# EasyEDA Pro project ProDocument_V3_2024-06-08.epro

# Schematic Schematic6
Create Date: 2024-04-19; Page Name: P1; Project Name: 变频器; Schematic Name: Schematic6; Update Date: 2024-04-24; Company: 嘉立创EDA; Page Size: A4; Version: V1.0
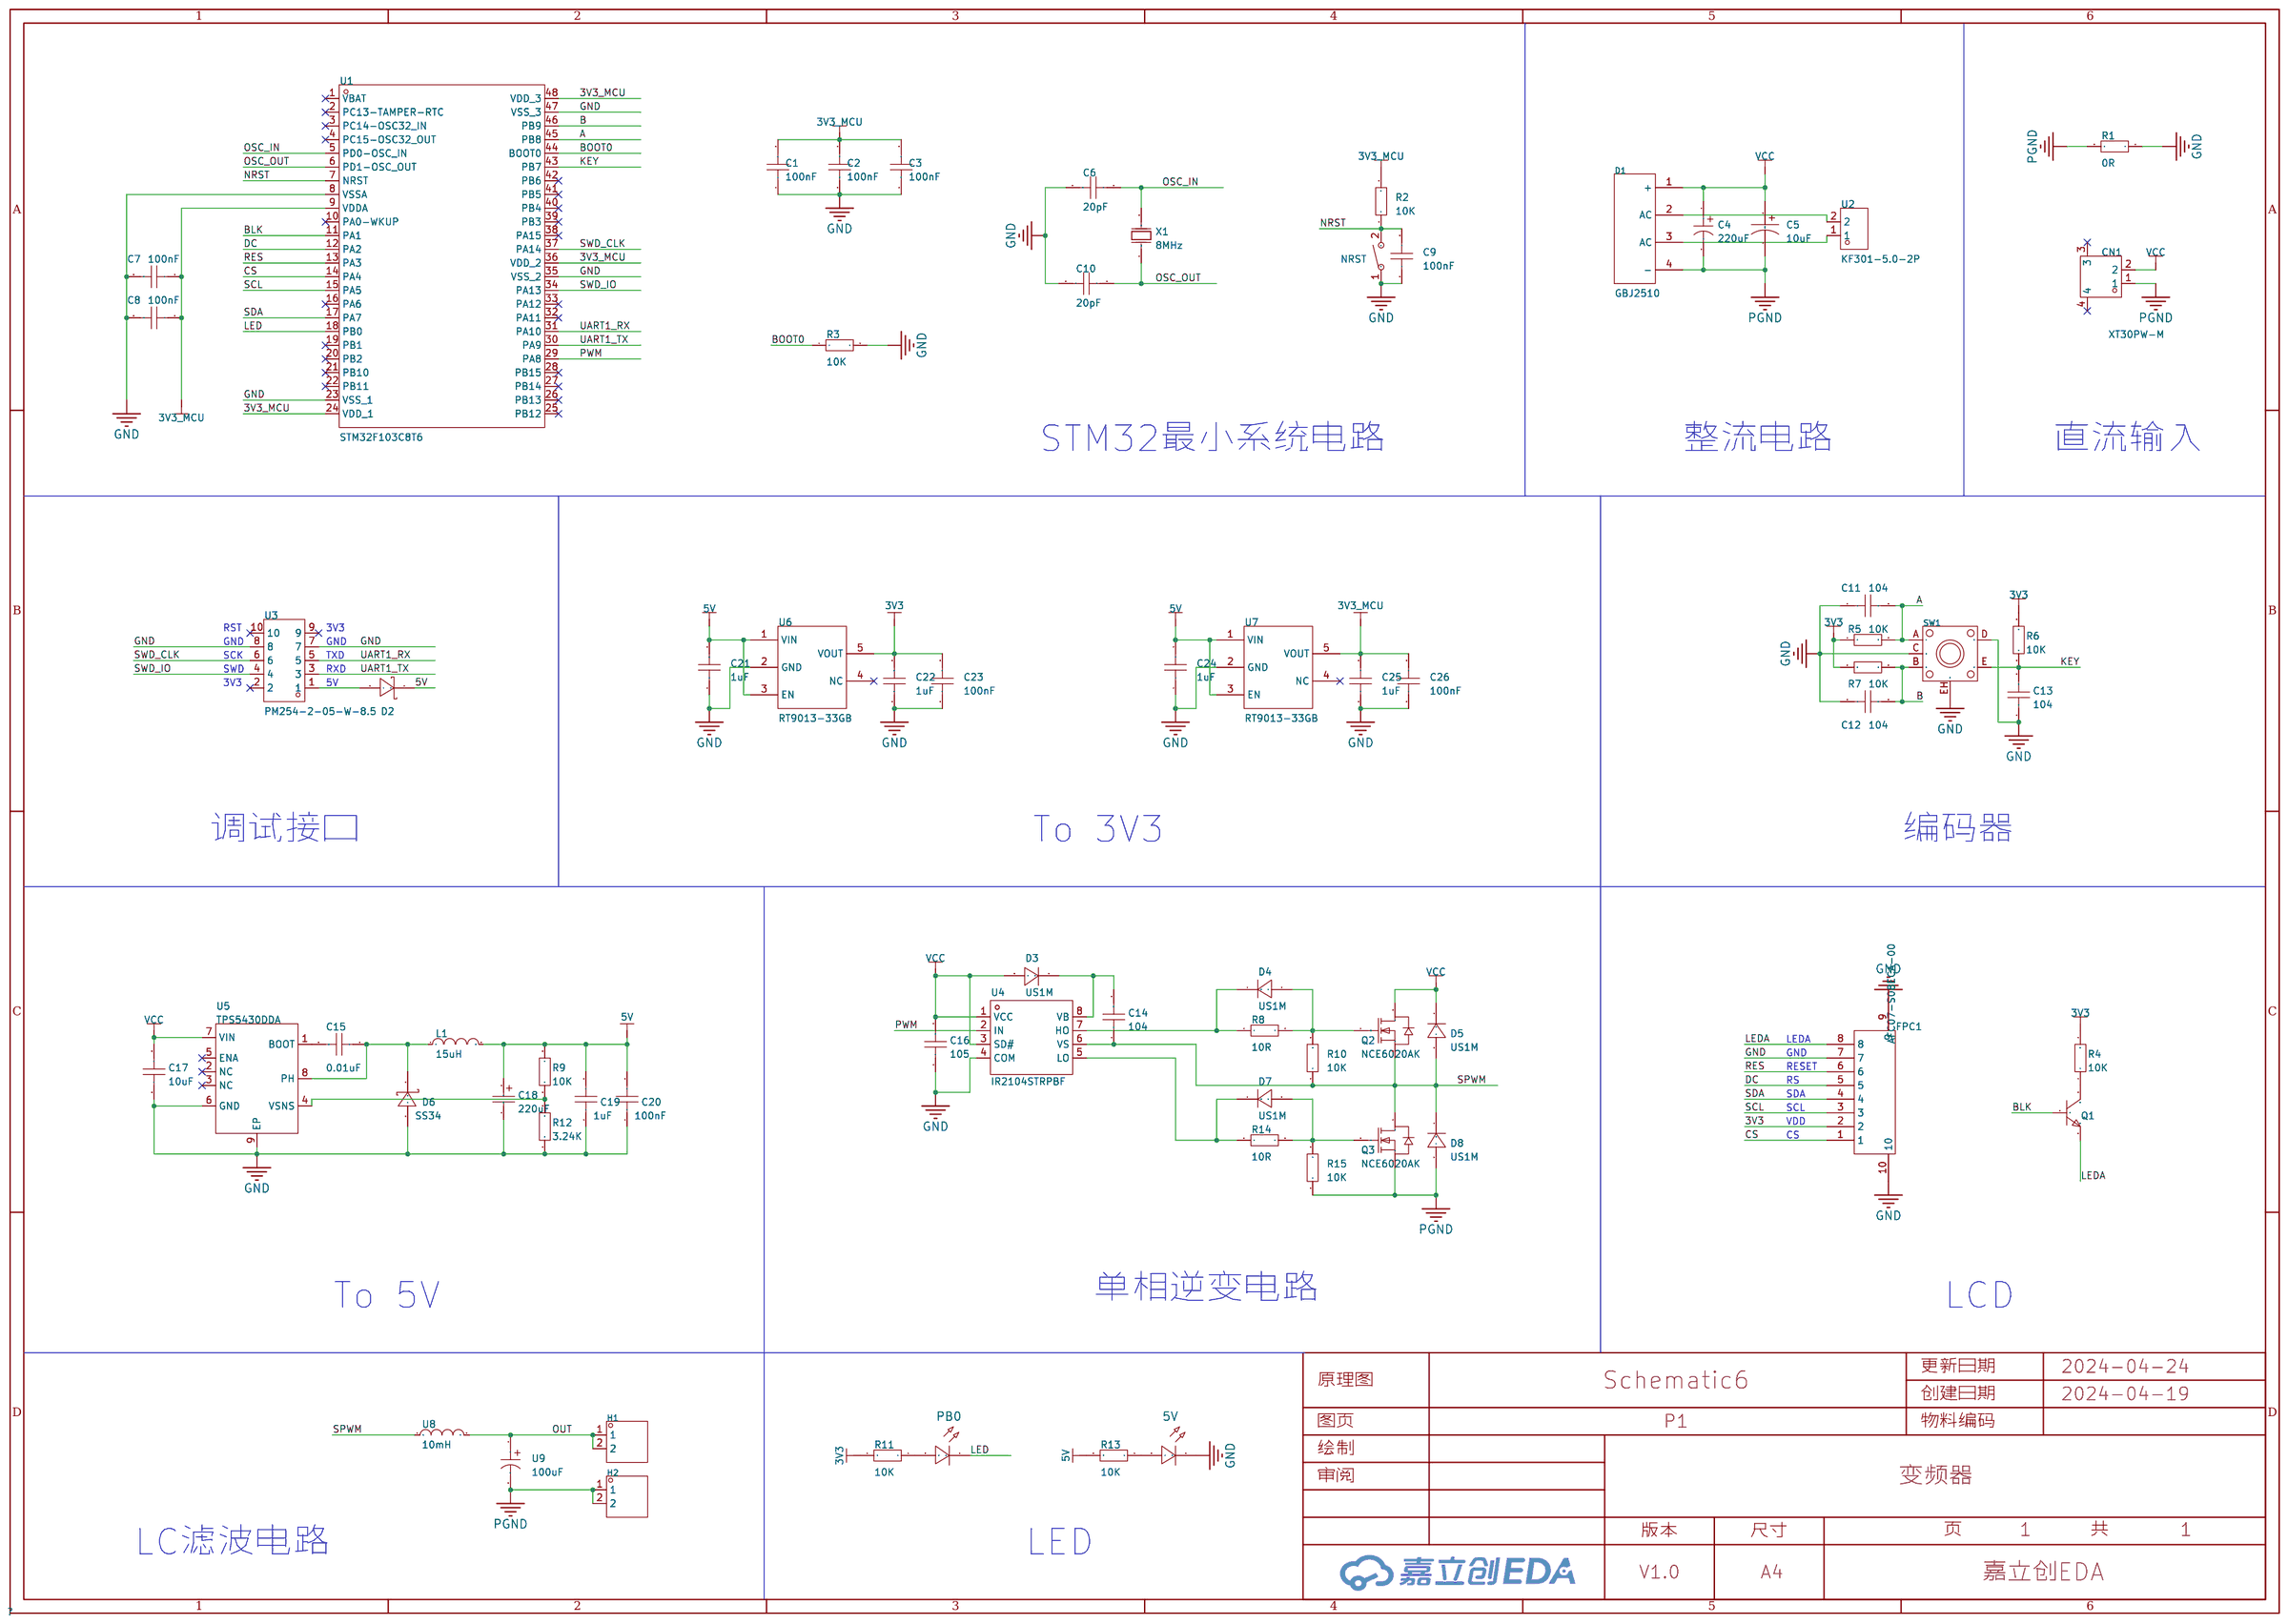
[diagram p0: schematic sheet]

## Parts
5V  -  [LED_0603]
C1  100nF  [C0603]
C2  100nF  [C0603]
C3  100nF  [C0603]
C4  220uF  [CAP-TH_BD8.0-P3.50-D0.6-FD]
C5  10uF  [CAP-TH_BD5.0-P2.00-D0.8-FD]
C6  20pF  [C0603]
C7  100nF  [C0603]
C8  100nF  [C0603]
C9  100nF  [C0603]
C10  20pF  [C0603]
C11  104  [C0603]
C12  104  [C0603]
C13  104  [C0603]
C14  104  [C0603]
C15  100nF  [C0603]
C16  105  [C0603]
C17  100nF  [C0603]
C18  220uF  [CASE-D_7343]
C19  100nF  [C0603]
C20  100nF  [C0603]
C21  100nF  [C0603]
C22  100nF  [C0603]
C23  100nF  [C0603]
C24  100nF  [C0603]
C25  100nF  [C0603]
C26  100nF  [C0603]
CN1  XT30PW-M  [CONN-TH_XT30PW-M]
D1  GBJ2510  [DIO-BG-TH_PB]
D2  1N5819WS  [SOD-323_L1.8-W1.3-LS2.5-RD]
D3  US1M  [SMA_L4.4-W2.8-LS5.4-RD]
D4  US1M  [SMA_L4.4-W2.8-LS5.4-RD]
D5  US1M  [SMA_L4.4-W2.8-LS5.4-RD]
D6  SS34  [SMA_L4.3-W2.6-LS5.2-RD]
D7  US1M  [SMA_L4.4-W2.8-LS5.4-RD]
D8  US1M  [SMA_L4.4-W2.8-LS5.4-RD]
FPC1  AFC07-S08ECA-00  [FPC-SMD_P0.5-8P_LCS-SH-H2.0]
H1  -  [HDR-TH_2P-P2.54-V-M-1]
H2  -  [HDR-TH_2P-P2.54-V-M-1]
L1  15uH  [IND-SMD_L7.0-W6.6_FXL0630]
NRST  TS-1071AD-A1B3-D4  [SW-SMD_L4.0-W3.0-LS4.8]
PB0  -  [LED_0603]
Q1  -  [S8050_SOT-23]
Q2  NCE6020AK  [TO-252-2_L6.6-W6.1-P4.57-LS10.1-TL-CW]
Q3  NCE6020AK  [TO-252-2_L6.6-W6.1-P4.57-LS10.1-TL-CW]
R1  0R  [R0603]
R2  10K  [R0603]
R3  10K  [R0603]
R4  10K  [R0603]
R5  10K  [R0603]
R6  10K  [R0603]
R7  10K  [R0603]
R8  10R  [R0603]
R9  10K  [R0603]
R10  10K  [R0603]
R11  10K  [R0603]
R12  10K  [R0603]
R13  10K  [R0603]
R14  10R  [R0603]
R15  10K  [R0603]
SW1  EC11N1520401  [SW-TH_EC11NXXXX]
U1  STM32F103C8T6  [LQFP-48_L7.0-W7.0-P0.50-LS9.0-BL]
U2  KF301-5.0-2P  [CONN-TH_P5.00_KF301-5.0-2P]
U3  PM254-2-05-W-8.5  [HDR-TH_10P-P2.54-H-F-R2-C5-W8.5]
U4  IR2104STRPBF  [SOIC-8_L4.9-W3.9-P1.27-LS6.0-BL]
U5  TPS5430DDA  [ESOP-8_L4.9-W3.9-P1.27-LS6.0-BL-EP-2]
U6  RT9013-33GB  [SOT-23-5_L3.0-W1.7-P0.95-LS2.8-BL]
U7  RT9013-33GB  [SOT-23-5_L3.0-W1.7-P0.95-LS2.8-BL]
U8  10mH  [IND-TH_BD10.0-P5.00-D0.6]
U9  100uF  [CAP-TH_BD8.0-P3.50-D0.6-FD]
X1  8MHz  [CRYSTAL-SMD_L5.0-W3.2]

## Library data of the parts
5V PB0 = LED_0603-R: Supplier Footprint: 0603
C1-C3 C6-C17 C19-C26 = CAP_0603: Supplier Footprint: 0603
C4 = 01EC3470: 容值:220uF;精度:±20%;额定电压:50V;纹波电流:350mA@120kHz;等效串联电阻:-;; LCSC Part Name: 220uF ±20% 50V; Supplier Part: C2836445; Manufacturer: KNSCHA(科尼盛); Supplier Footprint: 插件,D8xL12mm; JLCPCB Part Class: 扩展库; Datasheet: https://atta.szlcsc.com/upload/public/pdf/source/20210528/C2836445_4EB3DEC3C45633977FB5495C9B2E1697.pdf; Supplier: LCSC; Tolerance: ±20%; Rated Voltage: 50V; Ripple Current: 350mA@120kHz; Lead Spacing: 3.5mm; φD: 8mm; L: 12mm; Lifetime @ Temp: 2000hrs@105℃; Operating Temperature: -40℃~+105℃
C5 = 01EC1809SHC10UF50V: 容值:10uF;精度:±20%;额定电压:50V;纹波电流:50mA@120Hz;等效串联电阻:-;; LCSC Part Name: 10uF ±20% 50V; Supplier Part: C503219; Manufacturer: KNSCHA(科尼盛); Supplier Footprint: 插件,D5xL11mm; JLCPCB Part Class: 扩展库; Datasheet: https://atta.szlcsc.com/upload/public/pdf/source/20200324/C503219_39D1683F20D4DB1C41D8BE9142629697.pdf; Supplier: LCSC; Tolerance: ±20%; Rated Voltage: 50V; Ripple Current: 50mA@120Hz; Lead Spacing: 2mm; φD: 5mm; L: 11mm; Lifetime @ Temp: 5000hrs@105℃
C18 = TAJD227K010RNJ: 容值:220uF;精度:±10%;额定电压:10V;等效串联电阻:500mΩ@100kHz;; LCSC Part Name: 220uF ±10% 10V; Supplier Part: C8024; Manufacturer: Kyocera AVX; Supplier Footprint: CASE-D-7343; JLCPCB Part Class: 扩展库; Datasheet: https://atta.szlcsc.com/upload/public/pdf/source/20160107/1457707750344.pdf; Supplier: LCSC; Tolerance: ±10%; Rated Voltage: 10V; Equivalent Series Resistance(ESR): 500mΩ@100kHz; Operating Temperature: -55℃~+125℃
CN1 = XT30PW-M: Socket,DCsupply,XT30,male,PIN:2; LCSC Part Name: XT30PW-M公头; Supplier Part: C431092; Manufacturer: AMASS(艾迈斯); Supplier Footprint: Through Hole; JLCPCB Part Class: Extended Part; Datasheet: https://atta.szlcsc.com/upload/public/pdf/source/20220222/6A9F22F7850E25B33E1BE430ADF8560B.pdf; Supplier: LCSC
D1 = GBJ2510_C27523: 正向压降(Vf):1.05V@12.5A;直流反向耐压(Vr):1kV;平均整流电流(Io):25A;正向浪涌电流(Ifsm):350A;; LCSC Part Name: 电压:1kV 电流:25A; Supplier Part: C27523; Manufacturer: MDD; Supplier Footprint: GBJ6; JLCPCB Part Class: Extended Part; Datasheet: https://atta.szlcsc.com/upload/public/pdf/source/20190305/C27523_422085F399E74C82CD07F90440620E8B.pdf; Supplier: LCSC; Forward Voltage (Vf@If): 1.05V@12.5A; Reverse Voltage (Vr): 1kV; Average Rectified Current (Io): 25A; Reverse Leakage Current (Ir): 10uA@1kV; Peak Forward Surge Current: 350A; Operating Temperature: -55℃~+150℃@(Tj)
D2 = 1N5819WS_C191023: 正向压降(Vf):600mV@1A;直流反向耐压(Vr):40V;平均整流电流(Io):1A;; LCSC Part Name: 电压:40V 电流:1A; Supplier Part: C191023; Manufacturer: Hottech(合科泰); Supplier Footprint: SOD-323; JLCPCB Part Class: Basic Part; Datasheet: https://atta.szlcsc.com/upload/public/pdf/source/20220428/3CB86FD8D28D653594B4E35F9D5AEFD9.pdf; Supplier: LCSC; Forward Voltage (Vf@If): 600mV@1A; Reverse Voltage (Vr): 40V; Average Rectified Current (Io): 1A
D3-D5 D7 D8 = US1M_C412437: 二极管配置:独立式;正向压降(Vf):1.7V@1A;直流反向耐压(Vr):1kV;平均整流电流(Io):1A;反向恢复时间(trr):75ns;; LCSC Part Name: 电压:1kV 电流:1A; Supplier Part: C412437; Manufacturer: MDD; Supplier Footprint: SMA; JLCPCB Part Class: Basic Part; Datasheet: https://atta.szlcsc.com/upload/public/pdf/source/20230314/F0756B025DF5B8F55B4CA0C779F501E8.pdf; Supplier: LCSC; Diode Configuration: 独立式; Forward Voltage (Vf@If): 1.7V@1A; Reverse Voltage (Vr): 1kV; Average Rectified Current (Io): 1A; Reverse Leakage Current: 5uA@1kV; Reverse Recovery Time (trr): 75ns; Operating Temperature: -50℃~+150℃@(Tj)
D6 = SS34_C8678: 二极管配置:独立式;直流反向耐压(Vr):40V;平均整流电流(Io):3A;正向压降(Vf):550mV@3A;反向电流(Ir):500uA@40V;; LCSC Part Name: 40V 3A 550mV@3A; Supplier Part: C8678; Manufacturer: MDD; Supplier Footprint: SMA(DO-214AC); JLCPCB Part Class: Basic Part; Datasheet: https://atta.szlcsc.com/upload/public/pdf/source/20220408/D0396E57A6E83C6AFC0ED25EC9EDE030.pdf; Supplier: LCSC; Diode Configuration: 独立式; Reverse Voltage (Vr): 40V; Average Rectified Current (Io): 3A; Forward Voltage (Vf@If): 550mV@3A; Reverse Leakage Current (Ir): 500uA@40V
FPC1 = AFC07-S08ECA-00: 间距:0.5mm;触点数量:8P;锁定特性:抽屉式;触点类型:上接;安装类型:卧贴;; LCSC Part Name: 间距:0.5mm P数:8P 抽屉式 上接; Supplier Part: C262581; Manufacturer: JS(钜硕电子); Supplier Footprint: SMD,P=0.5mm,卧贴; JLCPCB Part Class: Extended Part; Datasheet: https://atta.szlcsc.com/upload/public/pdf/source/20190726/C11082_A2E7B12387019CE4314BB5199EE0FDF4.pdf; Supplier: LCSC; Pitch: 0.5mm; Number of Contacts: 8P; Locking Feature: 抽屉式; FFC, FCB Thickness: 0.3mm; Contact Type: 上接; Mounting Type: 卧贴; Height Above Board: 2mm
H1 H2 = HDR-M_2.54_1x2P: Supplier Part: C124375; Supplier Footprint: 插件
L1 = FXL0630-150-M: 电感值:15uH;精度:±20%;额定电流:3A;饱和电流(Isat):4.5A;类型:一体成型电感;; LCSC Part Name: 15uH ±20% 4.5A; Supplier Part: C177243; Manufacturer: cjiang(长江微电); Supplier Footprint: SMD,6.6x7mm; JLCPCB Part Class: Extended Part; Datasheet: https://atta.szlcsc.com/upload/public/pdf/source/20230516/3A080F5AF8C87BB81C3BA86E5F60E51A.pdf; Supplier: LCSC; Tolerance: ±20%; Rated Current: 3A; Saturation Current (Isat): 4.5A; DC Resistance (DCR): 115mΩ; Type: 一体成型电感
NRST = TS-1071AD-A1B3-D4: 电路结构:单刀单掷;按钮形状:圆形按钮;作用力:250gf;安装方式:-;开关长度:4mm;开关宽度:3mm;开关高度:2mm;带灯:-;机械寿命:-;; LCSC Part Name: 轻触开关4.0*3.0*2两脚贴片无柱小龟250gf; Supplier Part: C492878; Manufacturer: Yuandi(元迪); JLCPCB Part Class: Extended Part; Datasheet: https://atta.szlcsc.com/upload/public/pdf/source/20200316/C492878_F665FC46291D1CEBBF5F4DDB4422506A.pdf; Supplier: LCSC; Circuit: 单刀单掷; Actuator Style: 圆形按钮; Operating Force: 250gf; Switch Length: 4mm; Switch Width: 3mm; Switch Height: 2mm
Q1 = S8050_SOT_NPN: Supplier Footprint: SOT-23
Q2 Q3 = NCE6020AK: 类型:N沟道;漏源电压(Vdss):60V;连续漏极电流(Id):20A;功率(Pd):45W;导通电阻(RDS(on)@Vgs,Id):35mΩ@10V,20A;阈值电压(Vgs(th)@Id):2.5V@250uA;; LCSC Part Name: N沟道 耐压:60V 电流:20A; Supplier Part: C108639; Manufacturer: NCE(无锡新洁能); Supplier Footprint: TO-252-2(DPAK); JLCPCB Part Class: Extended Part; Datasheet: https://atta.szlcsc.com/upload/public/pdf/source/20231201/F7F8CF8E769EE35C01C69D8E45471040.pdf; Supplier: LCSC; Type: N沟道; Drain Source Voltage (Vdss): 60V; Continuous Drain Current (Id): 20A; Power Dissipation (Pd): 45W; Drain Source On Resistance (RDS(on)@Vgs,Id): 35mΩ@10V,20A; Gate Threshold Voltage (Vgs(th)@Id): 2.5V@250uA
R1-R15 = Res_0603: Supplier Footprint: 0603
SW1 = EC11N1520401: Supplier Part: C470703; Manufacturer: ALPSALPINE(阿尔卑斯阿尔派); Supplier Footprint: 插件; JLCPCB Part Class: 扩展库; Datasheet: https://atta.szlcsc.com/upload/public/pdf/source/20191216/C470795_DE763ECE59BD49533DB26DB53E5D34B2.pdf; Supplier: LCSC
U1 = STM32F103C8T6: CPU内核:CM3;程序存储容量:64KB;RAM总容量:20KB;GPIO端口数量:37;工作电压范围:2V~3.6V;CPU最大主频:72MHz;程序存储器类型:FLASH;; LCSC Part Name: STM32F103C8T6 MSL=3; Supplier Part: C8734; Manufacturer: ST(意法半导体); Supplier Footprint: LQFP-48(7x7); JLCPCB Part Class: 扩展库; Datasheet: https://atta.szlcsc.com/upload/public/pdf/source/20220812/8363ACEC51AD55ECEB84799464F7CB85.pdf; Supplier: LCSC; CPU Core: CM3; Program Storage Size: 64KB; RAM Size: 20KB; GPIO Ports Number: 37; Operating Voltage Range: 2V~3.6V; CPU Maximum Speed: 72MHz; Program Memory Type: FLASH; Operating Temperature Range: -40℃~+85℃; ADC (Bit): 12bit; Universal Serial Bus: 有; Peripheral/Function: 看门狗；DMA；看门狗；片载温度传感器; Watchdog: 有; Infrared Data Association: 有; Low-Voltage Detect: 有; Direct Memory Access: 有; Internal Oscillator: 有
U2 = KF301-5.0-2P: 结构:1x2P;间距:5mm;颜色:蓝色;安装方式:直插;额定电流:17A;额定电压:250V;排数:1;线规 - AWG:14~22;线规 - 平方毫米:1.5;每排PIN数:2;工作温度范围:-30℃~+120℃;; LCSC Part Name: 5mm 1x2P 排数:1 每排P数:2 直插; Supplier Part: C474881; Manufacturer: KEFA(科发); Supplier Footprint: 插件,P=5mm; JLCPCB Part Class: 扩展库; Datasheet: https://atta.szlcsc.com/upload/public/pdf/source/20230317/03A5B5FC229D6F9225E8F51DA1A4E80A.pdf; Supplier: LCSC; Structure: 1x2P; Pitch: 5mm; Color: 蓝色; Mounting Style: 直插; Current Rating (Max): 17A; Voltage Rating (Max): 250V; Number of Pins: 2P; Number of Rows: 1; Wire Gauge - AWG: 14~22; Wire Gauge - mm2: 1.5; Number of PINs Per Row: 2; Operating Temperature Range: -30℃~+120℃
U3 = PM254-2-05-W-8.5: 排数:双排;总孔位数:10P;间距:2.54mm;插孔结构:2x5P;行距:2.54mm;安装类型:弯插;圆孔/方孔:方孔;额定电流:3A;额定电压:-;插孔方向:侧面;塑高:8.5mm;工作温度范围:-40℃~+105℃;; LCSC Part Name: 间距:2.54mm 2x5P 弯插; Supplier Part: C2897425; Manufacturer: HCTL(华灿天禄); Supplier Footprint: 弯插,P=2.54mm; JLCPCB Part Class: 扩展库; Datasheet: https://atta.szlcsc.com/upload/public/pdf/source/20230609/283C0D22EF4E6FFE03D5A855876981ED.pdf; Supplier: LCSC; Number of Rows: 双排; Number of Holes: 10P; Pitch: 2.54mm; Holes Structure: 2x5P; Row Spacing: 2.54mm; Mounting Type: 弯插; Circular Hole / Square Hole: 方孔; Current Rating (Max): 3A; Holes Direction: 侧面; Insulation Height: 8.5mm; Operating Temperature Range: -40℃~+105℃
U4 = IR2104STRPBF: 驱动配置:半桥;负载类型:MOSFET；IGBT;驱动通道数:2;峰值灌电流:360mA;峰值拉电流:210mA;电源电压:10V~20V;上升时间:100ns;下降时间:50ns;; Supplier Part: C2960; Manufacturer: Infineon(英飞凌); Supplier Footprint: SOIC-8; JLCPCB Part Class: 扩展库; Datasheet: https://atta.szlcsc.com/upload/public/pdf/source/20140906/1457707236579.pdf; Supplier: LCSC; Driven Configuration: 半桥; Load Type: MOSFET；IGBT; Number of Drivers: 2; Peak Output Current(sink): 360mA; Peak Output Current(source): 210mA; Supply Voltage: 10V~20V; Rise Time: 100ns; Fall Time: 50ns; Operating Temperature: -40℃~+150℃@(Tj)
U5 = TPS5430DDA: 功能类型:降压型;同步整流:否;输出类型:可调;输出通道数:1;拓扑结构:降压式;输入电压:5.5V~36V;输出电压:1.221V~32.04V;输出电流(最大值):3A;开关频率:500kHz;工作温度:-40~+125@(TJ);; LCSC Part Name: 降压型 Vin=5.5V~36V Vout=1.221V~32.04V 3A; Supplier Part: C502477; Manufacturer: TI(德州仪器); Supplier Footprint: ESOP-8; JLCPCB Part Class: Extended Part; Datasheet: https://atta.szlcsc.com/upload/public/pdf/source/20200402/C502477_C195E9F29489A337252CB245AFB38C93.pdf; Supplier: LCSC; Function: 降压型; Synchronous Rectification: 否; Output Type: 可调; Number of Outputs: 1; Topology: 降压式; Input Voltage: 5.5V~36V; Output Voltage: 1.221V~32.04V; Output Current (Max): 3A; Switching Frequency: 500kHz; Operating Temperature: -40~+125@(TJ)
U6 U7 = RT9013-33GB: 输出类型:固定;最大输入电压:5.5V;输出电压:3.3V;最大输出电流:500mA;电源纹波抑制比(PSRR):50dB@(10kHz);输出极性:正极;; LCSC Part Name: 输入5.5V 输出3.3V 500mA; Supplier Part: C47773; Manufacturer: RICHTEK(立锜); Supplier Footprint: SOT-23-5; JLCPCB Part Class: 扩展库; Datasheet: https://atta.szlcsc.com/upload/public/pdf/source/20150504/1457707282459.pdf; Supplier: LCSC; Output Type: 固定; Maximum Input Voltage: 5.5V; Output Voltage: 3.3V; MAX Output Current: 500mA; Power Supply Rejection Ratio (PSRR): 50dB@(10kHz); Dropout Voltage: 400mV@(500mA); standby current: 50uA; Operating Temperature: -40℃~+85℃; Output Polarity: 正极; Number of Outputs: 1
U8 = XR8*10-101K-L: 电感值:100uH;精度:±10%;类型:工字电感;; LCSC Part Name: 100uH ±10% 工字电感; Supplier Part: C5380241; Manufacturer: XR(祥如); Supplier Footprint: 插件,D8xL10mm; JLCPCB Part Class: 扩展库; Datasheet: https://atta.szlcsc.com/upload/public/pdf/source/20230323/E8473EC4B67CAA12E996DDE863677D9C.pdf; Supplier: LCSC; Tolerance: ±10%; Type: 工字电感
U9 = 8471LCM0812LEN91EC: 容值:470uF;精度:±20%;额定电压:16V;; LCSC Part Name: 470uF ±20% 16V; Supplier Part: C5346386; Manufacturer: FH(风华); Supplier Footprint: 直插,D8xL12mm; JLCPCB Part Class: Extended Part; Datasheet: https://atta.szlcsc.com/upload/public/pdf/source/20230112/BBAEF8379DDF9FCDF3CF9581580F9F7A.pdf; Supplier: LCSC; Tolerance: ±20%; Rated Voltage: 16V; φD: 8mm; L: 12mm
X1 = X50328MSB2GI: 晶振类型:贴片晶振;频率:8MHz;常温频差:±10ppm;外接负载电容:20pF;频率稳定度(全温):±20ppm;; LCSC Part Name: 8MHz ±10ppm 20pF YSX530GA; Supplier Part: C115962; Manufacturer: YXC(扬兴晶振); Supplier Footprint: SMD5032; JLCPCB Part Class: 基础库; Datasheet: https://atta.szlcsc.com/upload/public/pdf/source/20240329/44922B0AF7B60E58E9B66993B6077277.pdf; Supplier: LCSC; Crystal Type: 贴片晶振; Normal temperature Frequency Tolerance: ±10ppm; External load capacitor: 20pF; Frequency Stability(Full temperature range): ±20ppm; Operating Temperature: -40℃~+85℃

## Nets
3V3: C22.2 C23.2 FPC1.2 R4.2 R5.1 R6.2 R7.1 R11.2 U6.5(VOUT)
3V3_MCU: C1.2 C2.2 C3.2 C7.1 C8.1 C25.2 C26.2 R2.2 U1.9(VDDA) U1.24(VDD_1) U1.36(VDD_2) U1.48(VDD_3) U7.5(VOUT)
5V: C18.1 C19.2 C20.2 C21.2 C24.2 D2.1(K) L1.2 R9.2 R13.2 U6.1(VIN) U6.3(EN) U7.1(VIN) U7.3(EN)
GND: 5V.1(C) C1.1 C2.1 C3.1 C6.2 C7.2 C8.2 C9.1 C10.2 C11.1 C12.1 C13.1 C16.1 C17.1 C18.2 C19.1 C20.1 C21.1 C22.1 C23.1 C24.1 C25.1 C26.1 D6.2(A) FPC1.7 FPC1.9 FPC1.10 NRST.1 R1.1 R3.2 R12.1 SW1.C SW1.D SW1.EH U1.8(VSSA) U1.23(VSS_1) U1.35(VSS_2) U1.47(VSS_3) U3.7 U3.8 U4.4(COM) U5.6(GND) U5.9(EP) U6.2(GND) U7.2(GND)
PGND: C4.2 C5.2 CN1.1 D1.4(-) D8.2(A) H2.1 H2.2 Q3.3(S) R1.2 R15.1 U9.2
VCC: C4.1 C5.1 C16.2 C17.2 CN1.2 D1.1(+) D3.2(A) D5.1(C) Q2.2(D) U4.1(VCC) U4.3(SD#) U5.7(VIN)
A: C11.2 R5.2 SW1.A U1.45(PB8)
B: C12.2 R7.2 SW1.B U1.46(PB9)
BLK: Q1.1 U1.11(PA1)
BOOT0: R3.1 U1.44(BOOT0)
CS: FPC1.1 U1.14(PA4)
DC: FPC1.5 U1.12(PA2)
KEY: C13.2 R6.1 SW1.E U1.43(PB7)
LED: PB0.1(C) U1.18(PB0)
LEDA: FPC1.8 Q1.2
NRST: C9.2 NRST.2 R2.1 U1.7(NRST)
OSC_IN: C6.1 U1.5(PD0-OSC_IN) X1.2(OSC2)
OSC_OUT: C10.1 U1.6(PD1-OSC_OUT) X1.1(OSC1)
OUT: H1.1 H1.2 U8.2 U9.1
PWM: U1.29(PA8) U4.2(IN)
RES: FPC1.6 U1.13(PA3)
SCL: FPC1.3 U1.15(PA5)
SDA: FPC1.4 U1.17(PA7)
SPWM: C14.1 D5.2(A) D8.1(C) Q2.3(S) Q3.2(D) R10.1 U4.6(VS) U8.1
SWD_CLK: U1.37(PA14) U3.6
SWD_IO: U1.34(PA13) U3.4
UART1_RX: U1.31(PA10) U3.5
UART1_TX: U1.30(PA9) U3.3
$1N2965: C14.2 D3.1(C) U4.8(VB)
$1N2966: D4.1(C) R8.1 U4.7(HO)
$1N2967: D4.2(A) Q2.1(G) R8.2 R10.2
$1N2968: D7.2(A) Q3.1(G) R14.2 R15.2
$1N2970: D7.1(C) R14.1 U4.5(LO)
$1N3077: PB0.2(A) R11.1
$1N3085: Q1.3 R4.1
$1N3092: 5V.2(A) R13.1
$1N3094: C15.2 U5.1(BOOT)
$1N3095: C15.1 D6.1(K) L1.1 U5.8(PH)
$1N3096: R9.1 R12.2 U5.4(VSNS)
$1N3109: D2.2(A) U3.1
$1N3116: D1.2(AC) U2.2
$1N3117: D1.3(AC) U2.1

Not connected (* = marked no-connect by the designer): CN1 3* 4*; U1 1(VBAT)* 2(PC13-TAMPER-RTC)* 3(PC14-OSC32_IN)* 4(PC15-OSC32_OUT)* 10(PA0-WKUP)* 16(PA6)* 19(PB1)* 20(PB2)* 21(PB10)* 22(PB11)* 25(PB12)* 26(PB13)* 27(PB14)* 28(PB15)* 32(PA11)* 33(PA12)* 38(PA15)* 39(PB3)* 40(PB4)* 41(PB5)* 42(PB6)*; U3 2* 9* 10*; U5 2(NC)* 3(NC)* 5(ENA)*; U6 4(NC)*; U7 4(NC)*

## Notes on the sheet
- STM32最小系统电路
- 整流电路
- 直流输入
- GND
- RST
- 3V3
- GND
- SCK
- TXD
- SWD
- RXD
- 3V3
- 5V
- 调试接口
- To 3V3
- 编码器
- LEDA
- GND
- RESET
- RS
- SDA
- SCL
- VDD
- CS
- To 5V
- 单相逆变电路
- LCD
- LC滤波电路
- LED

# Board PCB9
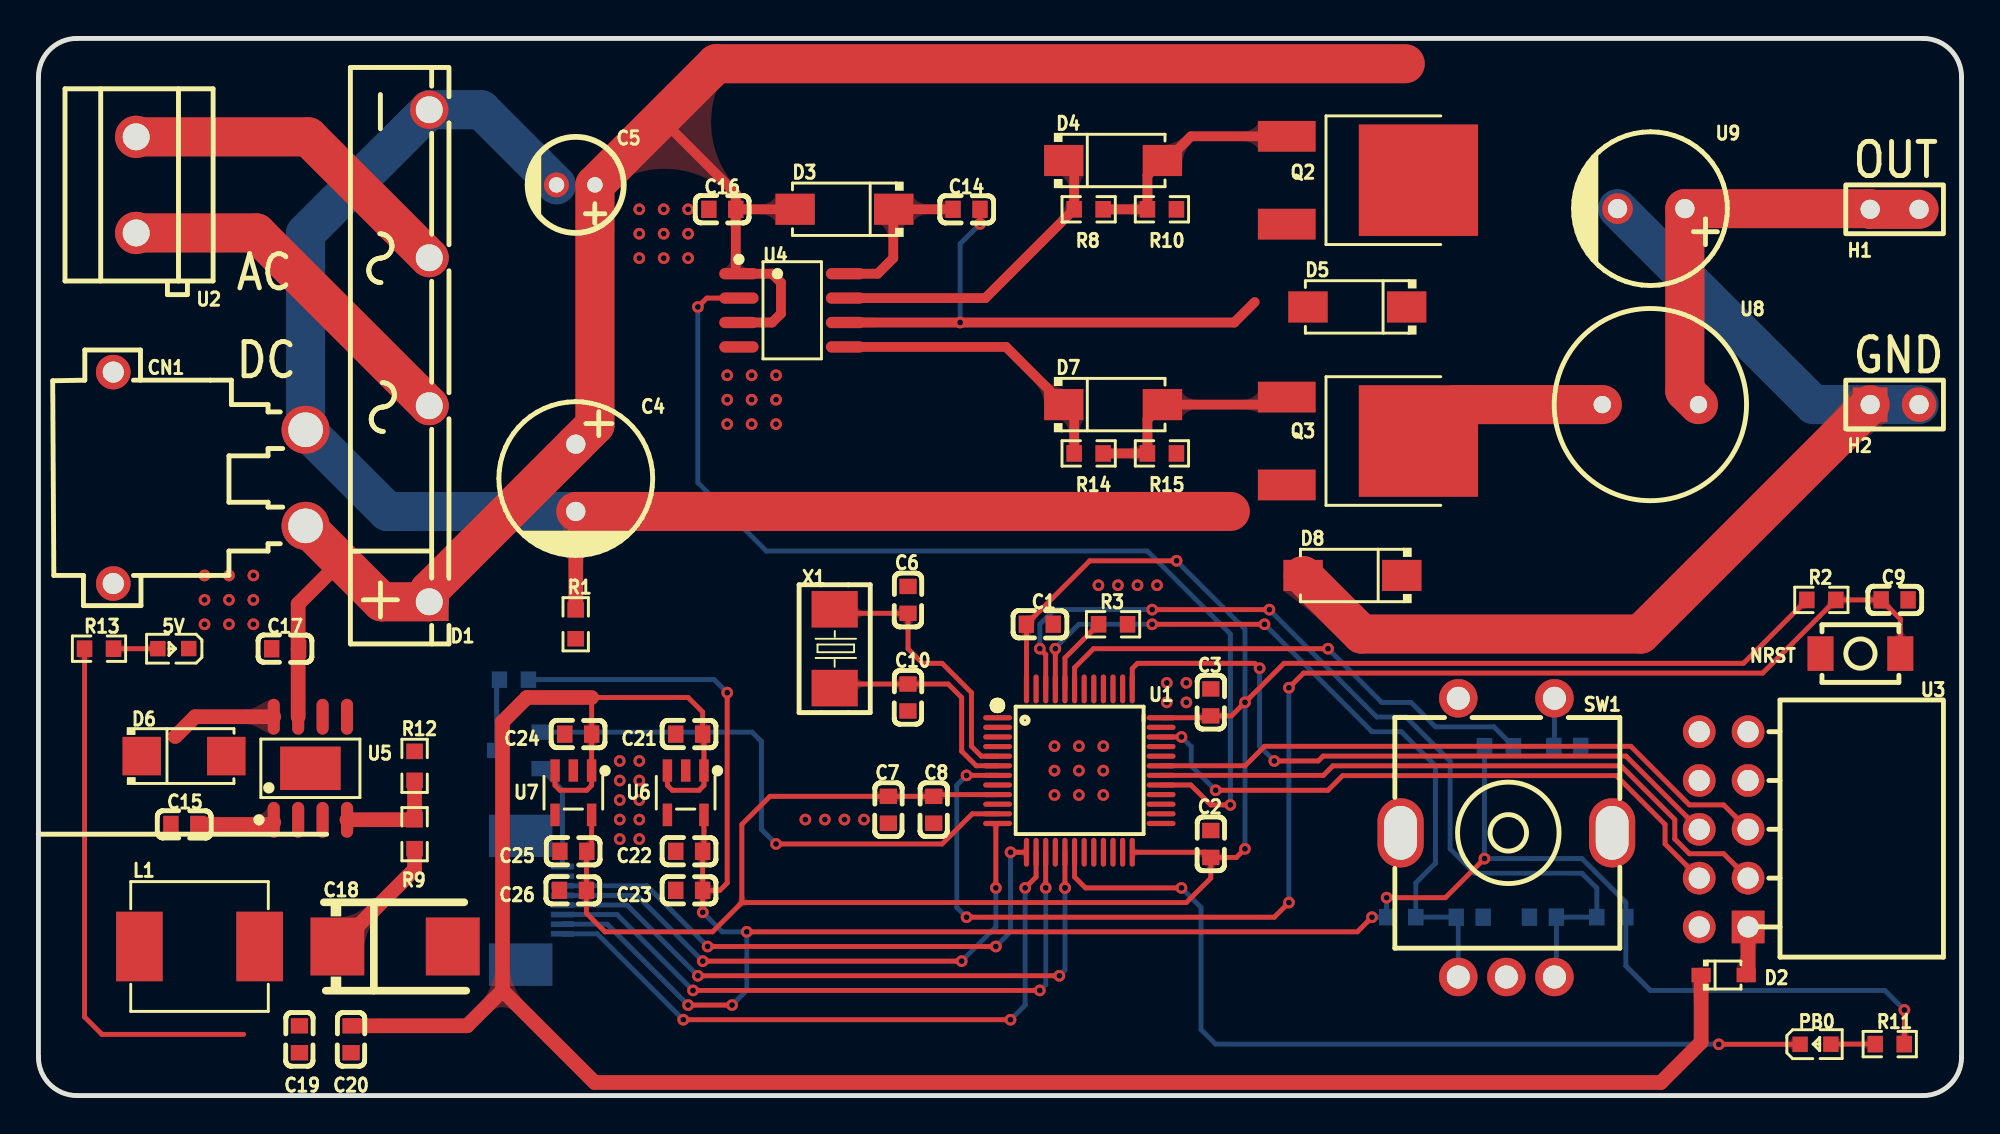
[diagram p1: board, top side]
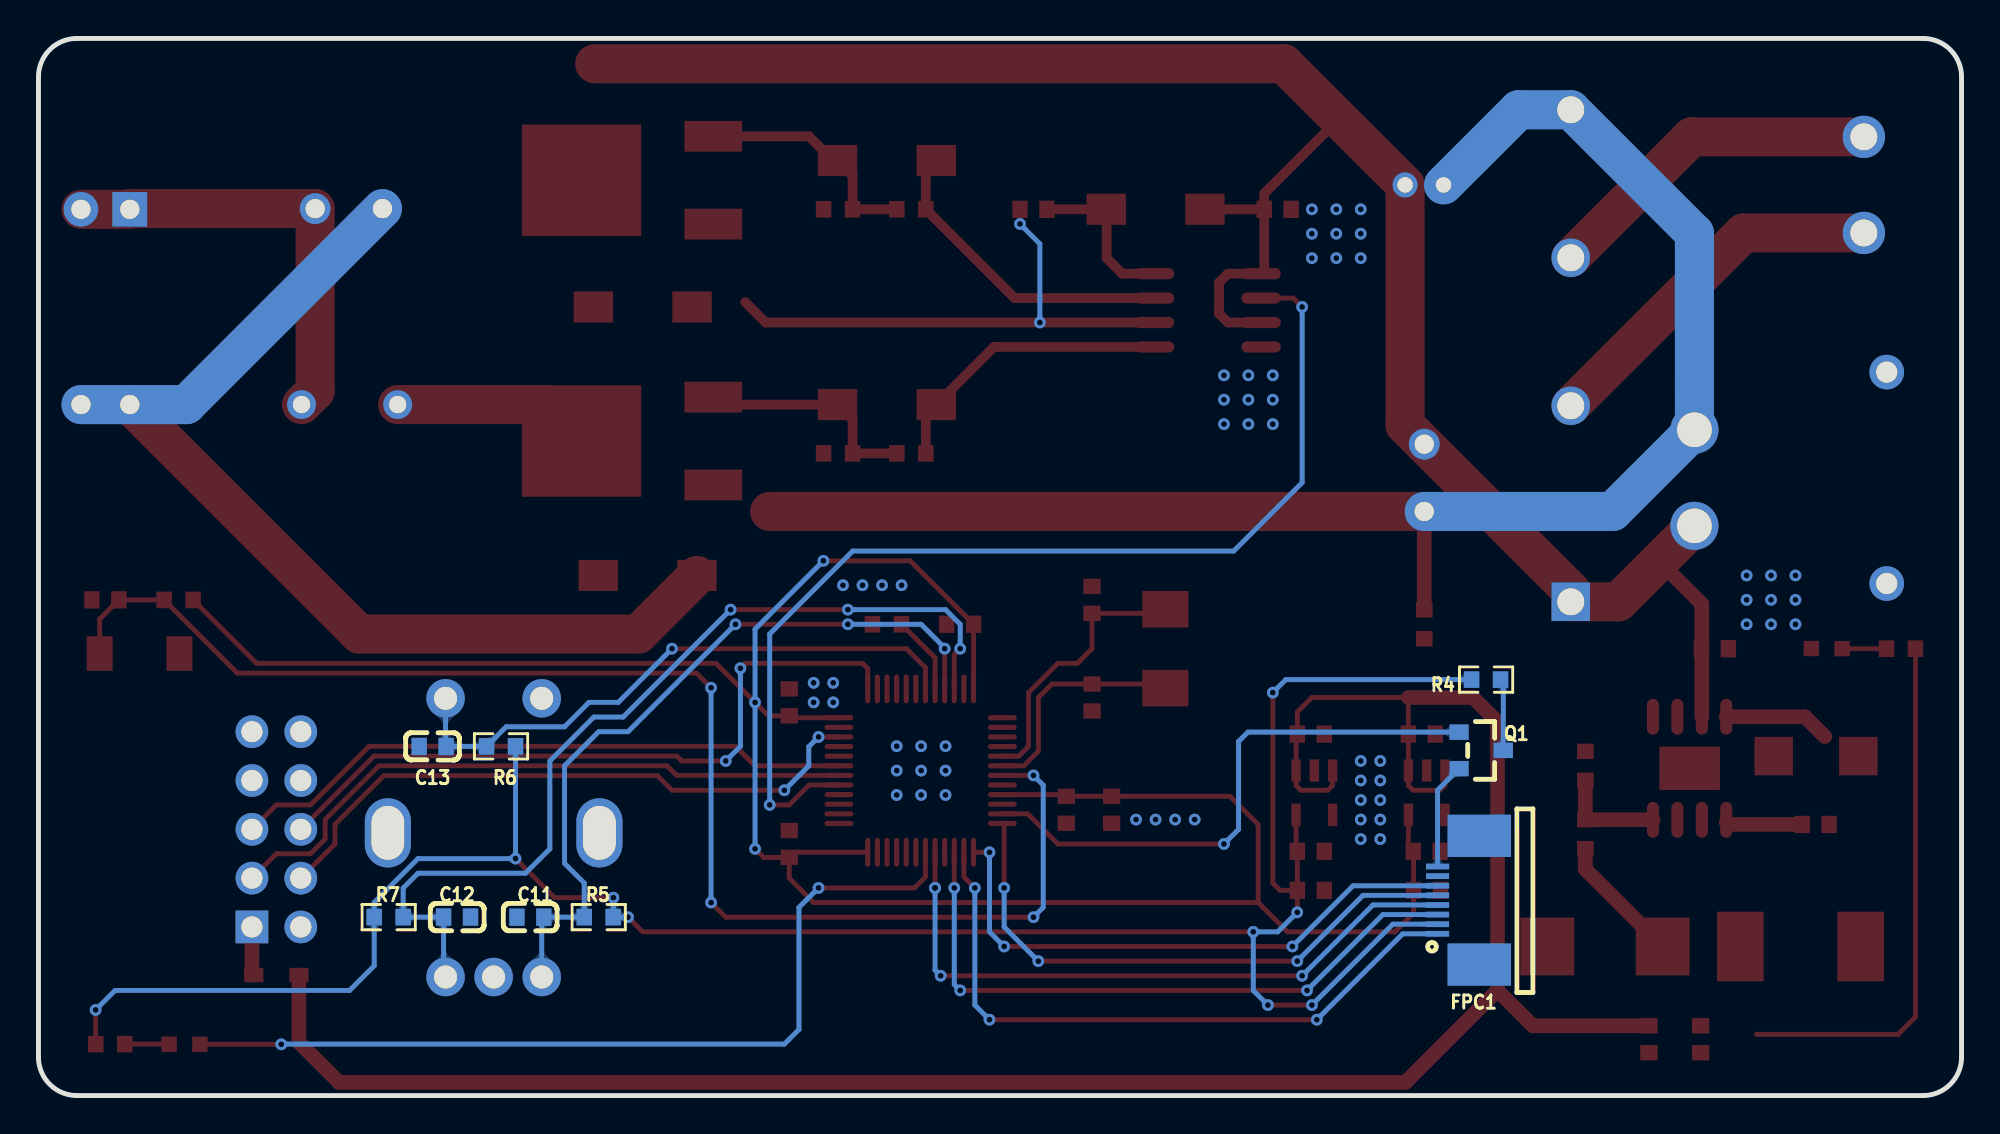
[diagram p2: board, bottom side, seen from below]

Outline 100 x 55 mm; copper layers: Top Layer, Bottom Layer. Coordinates in mm from the lower left corner of the outline.
Outline path: 0,53 0,2 arc(0.59,0.59) 2,0 98,0 arc(99.41,0.59) 100,2 100,53 arc(99.41,54.41) 98,55 2,55 arc(0.59,54.41) 0,53
Stack: Top Layer 0.035mm / Dielectric1 1.51mm FR4 er 4.5 / Bottom Layer 0.035mm

## Design rules (mm)
template: 自定义配置
spacing copperThickness1oz (default): track to track 0.102, other pairs 0.152 to 0.3
spacing copperThickness2oz: track to track 0.203, other pairs 0.152 to 0.3
track width copperThickness1oz (default): min 0.127, default 0.254, max 2.54
track width copperThickness2oz: min 0.203, default 0.254, max 2.54
differential pair differentialPair (default): width min 0.127, default 0.254, max 2.54; gap min 0.152, default 0.152
via viaSize (default): diameter min 0.5, default 0.61, max 10; hole min 0.3, default 0.305, max 6.3

## Placement (name value [footprint] x y rotation side)
5V  -  [LED_0603]  6.96 23.25 180 top
C1  100nF  [C0603]  52.07 24.52 180 top
C2  100nF  [C0603]  60.96 13.09 270 top
C3  100nF  [C0603]  60.96 20.46 270 top
C4  220uF  [CAP-TH_BD8.0-P3.50-D0.6-FD]  27.94 32.14 270 top
C5  10uF  [CAP-TH_BD5.0-P2.00-D0.8-FD]  27.94 47.38 180 top
C6  20pF  [C0603]  45.22 25.79 90 top
C7  100nF  [C0603]  44.2 14.87 270 top
C8  100nF  [C0603]  46.55 14.87 270 top
C9  100nF  [C0603]  96.52 25.79 180 top
C10  20pF  [C0603]  45.21 20.71 270 top
C11  104  [C0603]  74.42 9.28 180 bottom
C12  104  [C0603]  78.23 9.29 0 bottom
C13  104  [C0603]  79.5 18.16 180 bottom
C14  104  [C0603]  48.26 46.11 180 top
C15  100nF  [C0603]  7.59 14.11 0 top
C16  105  [C0603]  35.56 46.11 0 top
C17  100nF  [C0603]  12.83 23.25 0 top
C18  220uF  [CASE-D_7343]  18.54 7.76 180 top
C19  100nF  [C0603]  13.57 2.93 90 top
C20  100nF  [C0603]  16.26 2.93 90 top
C21  100nF  [C0603]  33.84 18.8 0 top
C22  100nF  [C0603]  33.84 12.71 0 top
C23  100nF  [C0603]  33.84 10.68 0 top
C24  100nF  [C0603]  28.07 18.8 0 top
C25  100nF  [C0603]  27.81 12.71 0 top
C26  100nF  [C0603]  27.79 10.68 0 top
CN1  XT30PW-M  [CONN-TH_XT30PW-M]  8.89 32.14 270 top
D1  GBJ2510  [DIO-BG-TH_PB]  20.32 38.49 90 top
D2  1N5819WS  [SOD-323_L1.8-W1.3-LS2.5-RD]  87.63 6.27 0 top
D3  US1M  [SMA_L4.4-W2.8-LS5.4-RD]  41.91 46.11 180 top
D4  US1M  [SMA_L4.4-W2.8-LS5.4-RD]  55.88 48.65 0 top
D5  US1M  [SMA_L4.4-W2.8-LS5.4-RD]  68.58 41.03 180 top
D6  SS34  [SMA_L4.3-W2.6-LS5.2-RD]  7.57 17.66 0 top
D7  US1M  [SMA_L4.4-W2.8-LS5.4-RD]  55.88 35.95 0 top
D8  US1M  [SMA_L4.4-W2.8-LS5.4-RD]  68.33 27.06 180 top
FPC1  AFC07-S08ECA-00  [FPC-SMD_P0.5-8P_LCS-SH-H2.0]  26.16 10.16 270 bottom
H1  -  [HDR-TH_2P-P2.54-V-M-1]  96.52 46.11 0 top
H2  -  [HDR-TH_2P-P2.54-V-M-1]  96.52 35.95 0 top
L1  15uH  [IND-SMD_L7.0-W6.6_FXL0630]  8.37 7.76 180 top
NRST  TS-1071AD-A1B3-D4  [SW-SMD_L4.0-W3.0-LS4.8]  94.74 23 0 top
PB0  -  [LED_0603]  92.46 2.68 0 top
Q1  -  [S8050_SOT-23]  24.98 18.09 0 bottom
Q2  NCE6020AK  [TO-252-2_L6.6-W6.1-P4.57-LS10.1-TL-CW]  68.33 47.62 0 top
Q3  NCE6020AK  [TO-252-2_L6.6-W6.1-P4.57-LS10.1-TL-CW]  68.33 34.05 0 top
R1  0R  [R0603]  27.94 24.52 90 top
R2  10K  [R0603]  92.71 25.79 180 top
R3  10K  [R0603]  55.88 24.52 0 top
R4  10K  [R0603]  24.72 21.64 0 bottom
R5  10K  [R0603]  70.87 9.28 0 bottom
R6  10K  [R0603]  75.95 18.17 180 bottom
R7  10K  [R0603]  81.79 9.28 180 bottom
R8  10R  [R0603]  54.61 46.11 0 top
R9  10K  [R0603]  19.56 13.6 270 top
R10  10K  [R0603]  58.42 46.11 180 top
R11  10K  [R0603]  96.27 2.68 0 top
R12  10K  [R0603]  19.56 17.15 270 top
R13  10K  [R0603]  3.15 23.25 180 top
R14  10R  [R0603]  54.61 33.41 0 top
R15  10K  [R0603]  58.42 33.41 180 top
SW1  EC11N1520401  [SW-TH_EC11NXXXX]  76.33 13.42 0 top
U1  STM32F103C8T6  [LQFP-48_L7.0-W7.0-P0.50-LS9.0-BL]  54.13 16.91 270 top
U2  KF301-5.0-2P  [CONN-TH_P5.00_KF301-5.0-2P]  5.08 47.38 270 top
U3  PM254-2-05-W-8.5  [HDR-TH_10P-P2.54-H-F-R2-C5-W8.5]  87.63 13.85 90 top
U4  IR2104STRPBF  [SOIC-8_L4.9-W3.9-P1.27-LS6.0-BL]  39.2 40.86 270 top
U5  TPS5430DDA  [ESOP-8_L4.9-W3.9-P1.27-LS6.0-BL-EP-2]  14.14 17.03 0 top
U6  RT9013-33GB  [SOT-23-5_L3.0-W1.7-P0.95-LS2.8-BL]  33.66 15.76 180 top
U7  RT9013-33GB  [SOT-23-5_L3.0-W1.7-P0.95-LS2.8-BL]  27.81 15.76 180 top
U8  10mH  [IND-TH_BD10.0-P5.00-D0.6]  83.82 35.95 0 top
U9  100uF  [CAP-TH_BD8.0-P3.50-D0.6-FD]  83.86 46.14 180 top
X1  8MHz  [CRYSTAL-SMD_L5.0-W3.2]  41.4 23.25 90 top

## Footprints (pads in the part's own frame, mm; a bottom-side part is the same pattern mirrored in y, then rotated)
C0603
  rect 0.8x0.9 smd: 1(-0.7,0) 2(0.7,0)
CAP-TH_BD5.0-P2.00-D0.8-FD
  round 1.3 hole 0.8: 1(-1,0) 2(1,0)
CAP-TH_BD8.0-P3.50-D0.6-FD
  round 1.6 hole 1: 1(-1.75,0) 2(1.75,0)
CASE-D_7343
  rect 2.799x3.01 smd: 1(3,0) 2(-3,0)
CONN-TH_P5.00_KF301-5.0-2P
  round 2.2 hole 1.4: 1(-2.5,0) 2(2.5,0)
CONN-TH_XT30PW-M
  round 2.5 hole 1.8: 1(-2.5,5) 2(2.5,5)
  round 1.8 hole 1.1: 3(5.5,-5) 4(-5.5,-5)
CRYSTAL-SMD_L5.0-W3.2
  rect 1.9x2.4 smd: 1(-2.05,0) 2(2.05,0)
DIO-BG-TH_PB
  rect 2x2 hole 1.4: 1(-12.8,0)
  round 2 hole 1.4: 2(-2.6,0) 3(5.1,0) 4(12.8,0)
ESOP-8_L4.9-W3.9-P1.27-LS6.0-BL-EP-2
  oval 0.63x1.865 smd: 1(-1.905,-2.683) 2(-0.635,-2.683) 3(0.635,-2.683) 4(1.905,-2.683) 5(1.905,2.683) 6(0.635,2.683) 7(-0.635,2.683) 8(-1.905,2.683)
  rect 3.15x2.26 smd: 9(0,0)
FPC-SMD_P0.5-8P_LCS-SH-H2.0
  rect 0.3x1.2 smd: 1(1.748,-1.084) 2(1.248,-1.084) 3(0.748,-1.084) 4(0.248,-1.084) 5(-0.252,-1.084) 6(-0.752,-1.084) 7(-1.252,-1.084) 8(-1.754,-1.083)
  rect 2.2x3.3 smd: 9(3.35,1.084) 10(-3.35,1.084)
HDR-TH_2P-P2.54-V-M-1
  rect 1.8x1.8 hole 1: 1(-1.27,0)
  round 1.8 hole 1: 2(1.27,0)
HDR-TH_10P-P2.54-H-F-R2-C5-W8.5
  rect 1.7x1.7 hole 1.1: 1(-5.08,-1.27)
  round 1.7 hole 1.1: 2(-5.08,1.27) 3(-2.54,-1.27) 4(-2.54,1.27) 5(0,-1.27) 6(0,1.27) 7(2.54,-1.27) 8(2.54,1.27) 9(5.08,-1.27) 10(5.08,1.27)
IND-SMD_L7.0-W6.6_FXL0630
  rect 2.424x3.62 smd: 1(3.128,0) 2(-3.128,0)
IND-TH_BD10.0-P5.00-D0.6
  round 1.5 hole 0.9: 1(-2.5,0) 2(2.5,0)
LED_0603
  rect 0.8x0.8 smd: 1(-0.851,-0.01) 2(0.75,-0.005)
LQFP-48_L7.0-W7.0-P0.50-LS9.0-BL
  oval 0.27x1.5 smd: 1(-2.75,-4.25) 2(-2.25,-4.25) 3(-1.75,-4.25) 4(-1.25,-4.25) 5(-0.75,-4.25) 6(-0.25,-4.25) 7(0.25,-4.25) 8(0.75,-4.25) 9(1.25,-4.25) 10(1.75,-4.25) 11(2.25,-4.25) 12(2.75,-4.25) 25(2.75,4.25) 26(2.25,4.25) 27(1.75,4.25) 28(1.25,4.25) 29(0.75,4.25) 30(0.25,4.25) 31(-0.25,4.25) 32(-0.75,4.25) 33(-1.25,4.25) 34(-1.75,4.25) 35(-2.25,4.25) 36(-2.75,4.25)
  oval 1.5x0.27 smd: 13(4.25,-2.75) 14(4.25,-2.25) 15(4.25,-1.75) 16(4.25,-1.25) 17(4.25,-0.75) 18(4.25,-0.25) 19(4.25,0.25) 20(4.25,0.75) 21(4.25,1.25) 22(4.25,1.75) 23(4.25,2.25) 24(4.25,2.75) 37(-4.25,2.75) 38(-4.25,2.25) 39(-4.25,1.75) 40(-4.25,1.25) 41(-4.25,0.75) 42(-4.25,0.25) 43(-4.25,-0.25) 44(-4.25,-0.75) 45(-4.25,-1.25) 46(-4.25,-1.75) 47(-4.25,-2.25) 48(-4.25,-2.75)
R0603
  rect 0.806x0.864 smd: 1(-0.753,0) 2(0.753,0)
S8050_SOT-23
  rect 1x0.8 smd: 1(1.15,-0.823) 2(1.15,1.077) 3(-1.15,0.127)
SMA_L4.3-W2.6-LS5.2-RD
  rect 2x2 smd: 1(-2.2,0) 2(2.2,0)
SMA_L4.4-W2.8-LS5.4-RD
  rect 2.046x1.62 smd: 1(-2.566,0) 2(2.566,0)
SOD-323_L1.8-W1.3-LS2.5-RD
  rect 1x0.75 smd: 1(-1.173,0) 2(1.173,0)
SOIC-8_L4.9-W3.9-P1.27-LS6.0-BL
  oval 0.588x2.045 smd: 1(-1.905,-2.772) 2(-0.635,-2.772) 3(0.635,-2.772) 4(1.905,-2.772) 5(1.905,2.772) 6(0.635,2.772) 7(-0.635,2.772) 8(-1.905,2.772)
SOT-23-5_L3.0-W1.7-P0.95-LS2.8-BL
  rect 0.49x1.157 smd: 1(-0.95,-1.153) 2(0,-1.153) 3(0.95,-1.153)
  rect 0.49x1.175 smd: 4(0.95,1.153) 5(-0.95,1.153)
SW-SMD_L4.0-W3.0-LS4.8
  rect 1.35x1.8 smd: 1(-2.075,0) 2(2.075,0)
SW-TH_EC11NXXXX
  round 2 hole 1.2: A(-2.5,-7.25) B(2.5,-7.25) C(0,-7.25) D(-2.5,7.25) E(2.5,7.25)
  oval 2.4x3.6 hole 1.7x2.8: EH(-5.5,0.25) EH(5.5,0.25)
TO-252-2_L6.6-W6.1-P4.57-LS10.1-TL-CW
  rect 3x1.6 smd: 1(-3.424,2.285) 3(-3.424,-2.285)
  rect 6.2x5.8 smd: 2(3.424,0)

## Nets
As in the schematic.

Pads without a net: CN1 3 4; U1 1 2 3 4 10 16 19 20 21 22 25 26 27 28 32 33 38 39 40 41 42; U3 2 9 10; U5 2 3 5; U6 4; U7 4

## Via types
v1: diameter 0.61, hole 0.305, Top Layer to Bottom Layer, 108 vias

## Routing (per net, layer and track width the routed paths; a pad name or vN(x,y) marks a point on that pad's centre or on a via; arc(x,y) is an arc through that point)
3V3: length 119.7
  Top Layer w0.254: v1(97.03,4.45) 97.03,2.68 R11.2 ; v1(35.81,20.96) 35.81,11.06 35.43,10.68 C23.2 ; C23.2 C22.2 34.61,12.78 34.61,14.6 ; C23.2 34.54,9.54 v1(34.54,9.53) ; v1(69.34,9.28) 68.58,8.52 v1(36.83,8.52) ; v1(70.1,10.3) 73.16,10.3 v1(75.19,12.33) ; v1(33.78,4.71) v1(36.07,4.71)
  Bottom Layer w0.254: v1(97.03,4.45) 96.01,5.47 83.82,5.47 82.54,6.75 R7.1 82.54,10.05 80.26,12.33 v1(75.19,12.33) R6.2 ; 70.1,9.29 R5.1 ; 70.1,9.29 70.09,9.28 v1(69.34,9.28) ; 70.1,9.29 v1(70.1,10.3) ; v1(36.07,4.71) 36.83,5.47 v1(36.83,8.52) 35.56,8.52 v1(34.54,9.53) ; R4.2 35.14,21.64 v1(35.81,20.96) ; FPC1.2 29.57,8.92 v1(33.78,4.71)
3V3_MCU: length 129.6
  Top Layer w0.254: C2.2 60.96,11.31 59.69,10.04 36.58,10.04 ; C2.2 62.29,12.39 v1(62.74,12.84) ; C2.2 60.69,12.66 U1.24 ; 36.58,10.04 36.58,14.11 38.04,15.57 C7.1 C8.1 46.64,15.66 U1.9 ; 36.58,10.04 35.05,8.52 29.46,8.52 28.49,9.49 C26.2 28.49,12.69 C25.2 28.76,12.96 U7.5 ; U1.48 51.38,24.52 C1.2 54.67,27.82 v1(59.18,27.82) ; U1.36 60.86,19.66 C3.2 62.04,19.76 v1(62.74,20.46) 64.77,22.49 88.66,22.49 R2.2
  Bottom Layer w0.254: v1(62.74,12.84) v1(62.74,20.46) 62.74,24.27 v1(59.18,27.82)
5V: length 151.3
  Top Layer w0.254: R13.2 2.4,4.09 3.3,3.18 10.67,3.18 ; U6.3 32.71,16.14 32.96,15.88 34.35,15.88 34.61,16.14 34.61,18.74 C21.2 34.54,19.95 33.78,20.71 28.77,20.71 C24.2 28.76,18.8 U7.1 28.76,16.14 28.51,15.88 27.12,15.88 26.86,16.14 26.86,16.91
  Top Layer w0.762: 24.13,5.47 24.13,19.44 25.4,20.71 28.77,20.71 ; 24.13,5.47 28.92,0.68 84.37,0.68 86.46,2.77 D2.1 ; 24.13,5.47 22.29,3.63 C20.2 ; C18.1 19.56,11.77 R9.2
GND:
  vias: v1(8.64,27.06) v1(8.64,25.79) v1(8.64,24.52) v1(9.91,27.06) v1(9.91,25.79) v1(9.91,24.52) v1(11.18,27.06) v1(11.18,25.79) v1(11.18,24.52) v1(30.23,17.41) v1(30.23,16.39) v1(30.23,15.38) v1(30.23,14.36) v1(30.23,13.34) v1(31.24,46.11) v1(31.24,44.84) v1(31.24,43.57) v1(31.24,17.41) v1(31.24,16.39) v1(31.24,15.38) v1(31.24,14.36) v1(31.24,13.34) v1(32.51,46.11) v1(32.51,44.84) v1(32.51,43.57) v1(33.78,46.11) v1(33.78,44.84) v1(33.78,43.57) v1(35.81,37.47) v1(35.81,36.2) v1(35.81,34.93) v1(37.08,37.47) v1(37.08,36.2) v1(37.08,34.93) v1(38.35,37.47) v1(38.35,36.2) v1(38.35,34.93) v1(39.88,14.36) v1(40.89,14.36) v1(41.91,14.36) v1(42.93,14.36) v1(52.83,18.18) v1(52.83,16.91) v1(52.83,15.64) v1(54.1,18.18) v1(54.1,16.91) v1(54.1,15.64) v1(55.12,26.55) v1(55.37,18.18) v1(55.37,16.91) v1(55.37,15.64) v1(56.13,26.55) v1(57.15,26.55) v1(58.17,26.55) v1(58.67,21.47) v1(58.67,20.46) v1(59.69,21.47) v1(59.69,20.46)
PGND: length 138.1
  Top Layer w0.762: R1.2 27.94,25.28 C4.2
  Top Layer w2.032: C4.2 61.98,30.39 ; H2.1 83.31,24.01 68.81,24.01 D8.2
  Bottom Layer w2.032: U9.2 92.31,35.95 H2.1 H2.2 ; C4.2 18.14,30.39 CN1.1 13.89,44.86 D1.4 23.03,51.29 C5.2
VCC: length 104.7
  Top Layer w0.508: 33.02,50.17 36.26,46.93 C16.2 ; D3.2 39.34,46.11 C16.2 ; C16.2 36.26,42.92 U4.1 38.15,42.76 38.61,42.3 38.61,40.68 38.15,40.22 U4.3
  Top Layer w0.762: 15.24,27.31 13.51,25.58 13.51,23.22 ; 13.51,19.71 13.51,23.22 ; 13.51,23.22 C17.2
  Top Layer w2.032: 71.07,53.68 35.24,53.68 C5.1 28.94,34.89 C4.1 20.32,26.27 D1.1 17.84,25.69 CN1.2
A: length 39.1
  Top Layer w0.254: U1.45 v1(52.88,23.25) ; v1(57.91,24.52) v1(63.75,24.52)
  Bottom Layer w0.254: SW1.A 73.83,9.17 C11.2 73.72,9.28 R5.2 71.62,11.06 72.64,12.08 72.64,17.15 70.87,18.93 69.34,18.93 v1(63.75,24.52) ; v1(52.88,23.25) 52.83,23.25 54.1,24.52 v1(57.91,24.52)
B: length 48.2
  Top Layer w0.254: v1(52.07,23.25) 52.38,22.94 U1.46 ; v1(64.01,25.28) v1(57.91,25.28)
  Bottom Layer w0.254: v1(57.91,25.28) 52.83,25.28 52.07,24.52 v1(52.07,23.25) ; v1(64.01,25.28) 69.6,19.69 71.12,19.69 73.41,17.41 73.41,12.84 74.68,11.57 80.26,11.57 81.03,10.8 R7.2 78.93,9.28 C12.2 78.93,6.27 SW1.B
BLK: length 29.5
  Top Layer w0.254: v1(38.35,13.09) 46.99,13.09 48.56,14.66 U1.11
  Bottom Layer w0.254: v1(38.35,13.09) 37.59,13.85 37.59,18.42 37.11,18.91 Q1.1
BOOT0: length 4.1
  Top Layer w0.254: U1.44 53.38,22.77 R3.1
CS: length 34.4
  Top Layer w0.254: v1(33.53,3.95) v1(50.55,3.95) ; U1.14 51.88,11.37 v1(51.31,10.8)
  Bottom Layer w0.254: FPC1.1 29.06,8.42 v1(33.53,3.95) ; v1(50.55,3.95) 51.31,4.71 v1(51.31,10.8)
DC: length 30.1
  Top Layer w0.254: U1.12 49.78,14.06 v1(49.78,10.8) ; v1(34.54,6.99) v1(48.01,6.99)
  Bottom Layer w0.254: v1(49.78,10.8) 49.78,8.77 v1(48.01,6.99) ; v1(34.54,6.99) 31.12,10.42 FPC1.5
KEY: length 31.1
  Top Layer w0.254: v1(67.06,23.25) 54.86,23.25 53.88,22.26 U1.43
  Bottom Layer w0.254: 78.8,18.17 R6.1 75.68,19.19 72.64,19.19 71.37,20.46 69.85,20.46 v1(67.06,23.25) ; 78.8,18.17 78.83,18.2 SW1.E ; 78.8,18.17 C13.2
LED: length 46.3
  Top Layer w0.254: U1.18 53.88,11.37 54.45,10.8 v1(59.44,10.8) ; PB0.1 v1(87.38,2.67)
  Bottom Layer w0.254: v1(87.38,2.67) 87.38,2.68 61.21,2.68 60.45,3.44 60.45,9.79 v1(59.44,10.8)
LEDA: length 5.6
  Bottom Layer w0.254: FPC1.8 27.24,15.89 Q1.2
NRST: length 73.6
  Top Layer w0.254: NRST.2 96.82,24.79 C9.2 95.82,25.79 R2.1 89.66,21.98 65.79,21.98 v1(65.02,21.22) ; U1.7 v1(48.26,16.66) ; v1(48.26,9.28) 64.26,9.28 v1(65.02,10.04)
  Bottom Layer w0.254: v1(48.26,9.28) 47.75,9.79 47.75,16.15 v1(48.26,16.66) ; v1(65.02,10.04) v1(65.02,21.22)
OSC_IN: length 14.4
  Top Layer w0.254: U1.5 49.03,17.66 48.51,18.17 48.51,20.96 46.99,22.49 45.97,22.49 45.22,23.24 C6.1 41.61,25.09 X1.2
OSC_OUT: length 12
  Top Layer w0.254: U1.6 48.76,17.16 48.01,17.92 48.01,20.71 47.31,21.41 C10.1 41.61,21.41 X1.1
OUT: length 22.7
  Top Layer w2.032: H1.2 H1.1 95.22,46.14 U9.1 85.61,36.66 U8.2
PWM: length 55.3
  Top Layer w0.254: U1.29 59.92,16.16 60.96,15.12 v1(61.98,15.12) ; U4.2 34.75,41.49 v1(34.29,41.03)
  Bottom Layer w0.254: v1(61.98,15.12) 61.98,24.01 57.66,28.33 37.85,28.33 34.29,31.89 v1(34.29,41.03)
RES: length 29.9
  Top Layer w0.254: v1(34.8,7.76) v1(49.78,7.76) ; U1.13 v1(50.55,12.66)
  Bottom Layer w0.254: FPC1.6 31.64,10.92 v1(34.8,7.76) ; v1(49.78,7.76) 50.55,8.52 v1(50.55,12.66)
SCL: length 33.8
  Top Layer w0.254: U1.15 v1(52.38,10.8) ; v1(34.04,5.47) v1(52.07,5.47)
  Bottom Layer w0.254: v1(52.07,5.47) 52.38,5.78 v1(52.38,10.8) ; FPC1.3 30.09,9.42 v1(34.04,5.47)
SDA: length 33.9
  Top Layer w0.254: U1.17 v1(53.38,10.8) ; v1(53.09,6.23) v1(34.29,6.23)
  Bottom Layer w0.254: FPC1.4 30.61,9.92 v1(34.29,6.23) ; v1(53.38,10.8) 53.38,6.52 v1(53.09,6.23)
SPWM: length 38.4
  Top Layer w0.254: v1(48.96,45.35) C14.1
  Top Layer w0.508: 63.25,41.28 62.18,40.22 v1(47.93,40.22) U4.6
  Top Layer w2.032: Q3.2 73.65,35.95 U8.1
  Bottom Layer w0.254: v1(47.93,40.22) 47.93,44.31 v1(48.96,45.35)
SWD_CLK: length 36.8
  Top Layer w0.254: U1.37 56.88,22.22 57.15,22.49 63.25,22.49 v1(63.5,22.23) ; U3.6 82.55,17.66 66.8,17.66 66.55,17.41 v1(64.26,17.41)
  Bottom Layer w0.254: v1(64.26,17.41) 63.5,18.17 v1(63.5,22.23)
SWD_IO: length 32.8
  Top Layer w0.254: v1(59.44,18.66) U1.34 ; U3.4 84.58,13.09 84.58,14.11 82.04,16.65 67.82,16.65 67.06,15.88 v1(61.21,15.88)
  Bottom Layer w0.254: v1(61.21,15.88) 59.94,17.15 59.94,18.15 v1(59.44,18.66)
UART1_RX: length 32.7
  Top Layer w0.254: U1.31 62.74,17.16 63.75,18.17 82.8,18.17 85.85,15.12 87.63,15.12 U3.5
UART1_TX: length 33.7
  Top Layer w0.254: U3.3 87.63,12.58 85.85,12.58 85.09,13.34 85.09,14.36 82.3,17.15 67.31,17.15 66.81,16.66 U1.30
$1N2965: length 8.5
  Top Layer w0.508: C14.2 47.56,46.11 D3.1 44.45,46.09 44.45,43.57 43.64,42.76 U4.8
$1N2966: length 16.6
  Top Layer w0.508: U4.7 49.24,41.49 R8.1 53.86,48.11 D4.1
$1N2967: length 11.9
  Top Layer w0.508: 58.67,48.65 59.93,49.91 Q2.1 ; D4.2 57.67,47.87 R10.2 R8.2
$1N2968: length 11.6
  Top Layer w0.508: Q3.1 64.52,35.95 58.67,35.95 ; R14.2 R15.2 57.67,35.17 D7.2
$1N2970: length 15.4
  Top Layer w0.508: U4.5 50.31,38.95 D7.1 53.86,35.41 R14.1
$1N3077: length 2.3
  Top Layer w0.254: R11.1 93.21,2.68 PB0.2
$1N3085: length 3.7
  Bottom Layer w0.254: R4.1 23.83,21.5 Q1.3
$1N3092: length 2.3
  Top Layer w0.254: R13.1 6.21,23.25 5V.2
$1N3094: length 4
  Top Layer w0.762: C15.2 12.12,14.11 12.23,14.22
$1N3095: length 5.6
  Top Layer w0.762: U5.8 8.14,19.71 7.11,18.68
$1N3096: length 5.6
  Top Layer w0.762: R12.2 R9.1 16.05,14.35 U5.4
$1N3109: length 2.5
  Top Layer w0.762: D2.2 88.9,6.37 U3.1
$1N3116: length 19
  Top Layer w2.032: D1.2 11.33,44.88 U2.2
$1N3117: length 17.8
  Top Layer w2.032: U2.1 14.03,49.88 D1.3

## Copper pours and planes (outline as drawn; the poured copper is in the pictures)
5V on Top Layer: 10.16,9.79 17.02,9.79 17.02,2.93 10.16,2.93
GND on Top Layer: 0,55 100.08,55 100.08,-0.12 0,-0.12
GND on Bottom Layer: 0,55 100.08,55 100.08,-0.12 0,-0.12
PGND on Top Layer: 58.67,33.92 61.98,33.92 63.25,32.65 66.55,32.65 66.55,28.58 67.31,27.82 67.31,26.04 62.23,26.04 58.67,29.6
VCC on Top Layer: 72.39,40.01 73.15,41.79 74.93,44.59 74.93,54.75 68.58,54.75 68.58,44.59 69.34,43.06 70.1,40.01
SPWM on Top Layer: 72.39,26.04 75.18,28.84 75.18,37.22 72.14,37.22 67.31,42.05 67.31,45.6 66.29,46.62 58.67,46.62 58.67,45.6 68.58,35.7 68.58,30.95 69.6,26.04
$1N3095 on Top Layer: 3.81,18.93 7.62,18.93 7.62,5.72 3.81,5.72

Small or netless copper shapes (teardrops, artwork), in the pictures only: 187 on Top Layer, 87 on Bottom Layer

## Text on the board
Top Silkscreen Layer: AC | DC | OUT | GND
